# Altium schematic sheet Sheet_Con.SchDoc
size A4
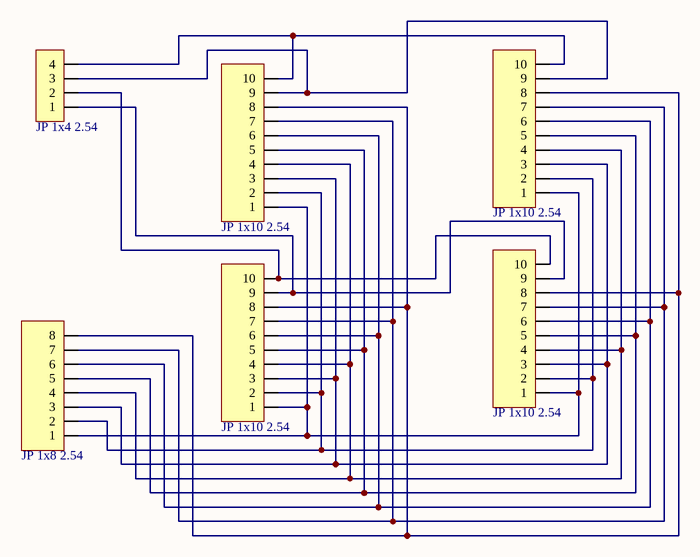
[diagram p0: Sheet_Con.SchDoc]

## Parts
7Seg11  JP 1x10 2.54  [JP 1x10 DT]
7Seg12  JP 1x10 2.54  [JP 1x10 DT]
7Seg21  JP 1x10 2.54  [JP 1x10 DT]
7Seg22  JP 1x10 2.54  [JP 1x10 DT]
Control7Seg  JP 1x4 2.54  [JP 1x4 DT]
led_pin  JP 1x8 2.54  [JP 1x8 DT]

## Nets
Net7Seg11_1: 7Seg11.1 7Seg12.1 7Seg21.1 7Seg22.1 led_pin.1
Net7Seg11_2: 7Seg11.2 7Seg12.2 7Seg21.2 7Seg22.2 led_pin.2
Net7Seg11_3: 7Seg11.3 7Seg12.3 7Seg21.3 7Seg22.3 led_pin.3
Net7Seg11_4: 7Seg11.4 7Seg12.4 7Seg21.4 7Seg22.4 led_pin.4
Net7Seg11_5: 7Seg11.5 7Seg12.5 7Seg21.5 7Seg22.5 led_pin.5
Net7Seg11_6: 7Seg11.6 7Seg12.6 7Seg21.6 7Seg22.6 led_pin.6
Net7Seg11_7: 7Seg11.7 7Seg12.7 7Seg21.7 7Seg22.7 led_pin.7
Net7Seg11_8: 7Seg11.8 7Seg12.8 7Seg21.8 7Seg22.8 led_pin.8
Net7Seg11_9: 7Seg11.9 7Seg12.9 Control7Seg.1
Net7Seg11_10: 7Seg11.10 7Seg12.10 Control7Seg.2
Net7Seg21_9: 7Seg21.9 7Seg22.9 Control7Seg.3
Net7Seg21_10: 7Seg21.10 7Seg22.10 Control7Seg.4

## Library data of the parts
7Seg11 7Seg12 7Seg21 7Seg22 = JP 1x10 2.54 Duc Thang: Cắm; Ten_Linh_Kien: Jump Đơn Đực 2.54MM 1x40P Thẳng 11MM; Don_Vi: Con; Ma_Hang: MH000903; Ghi_Chu: *; Kieu_Chan: *; Chung_Loai: Cắm
Control7Seg = JP 1x4 2.54 Duc Thang: Cắm; Ten_Linh_Kien: Jump Đơn Đực 2.54MM 1x40P Thẳng 11MM; Don_Vi: Con; Ma_Hang: MH000903; Ghi_Chu: *; Kieu_Chan: *; Chung_Loai: Cắm
led_pin = JP 1x8 2.54 Duc Thang: Cắm; Ten_Linh_Kien: Jump Đơn Đực 2.54MM 1x40P Thẳng 11MM; Don_Vi: Con; Ma_Hang: MH000903; Ghi_Chu: *; Kieu_Chan: *; Chung_Loai: Cắm